# EAGLE design ft4222h (EAGLE 9.3.2)
COMPANY: IPL; CREVISION: V1.0; DESIGNER: Rafael Silva; LICENSE: GNU General Public License v3.0; LINK: https://github.com/gimbas/fmc
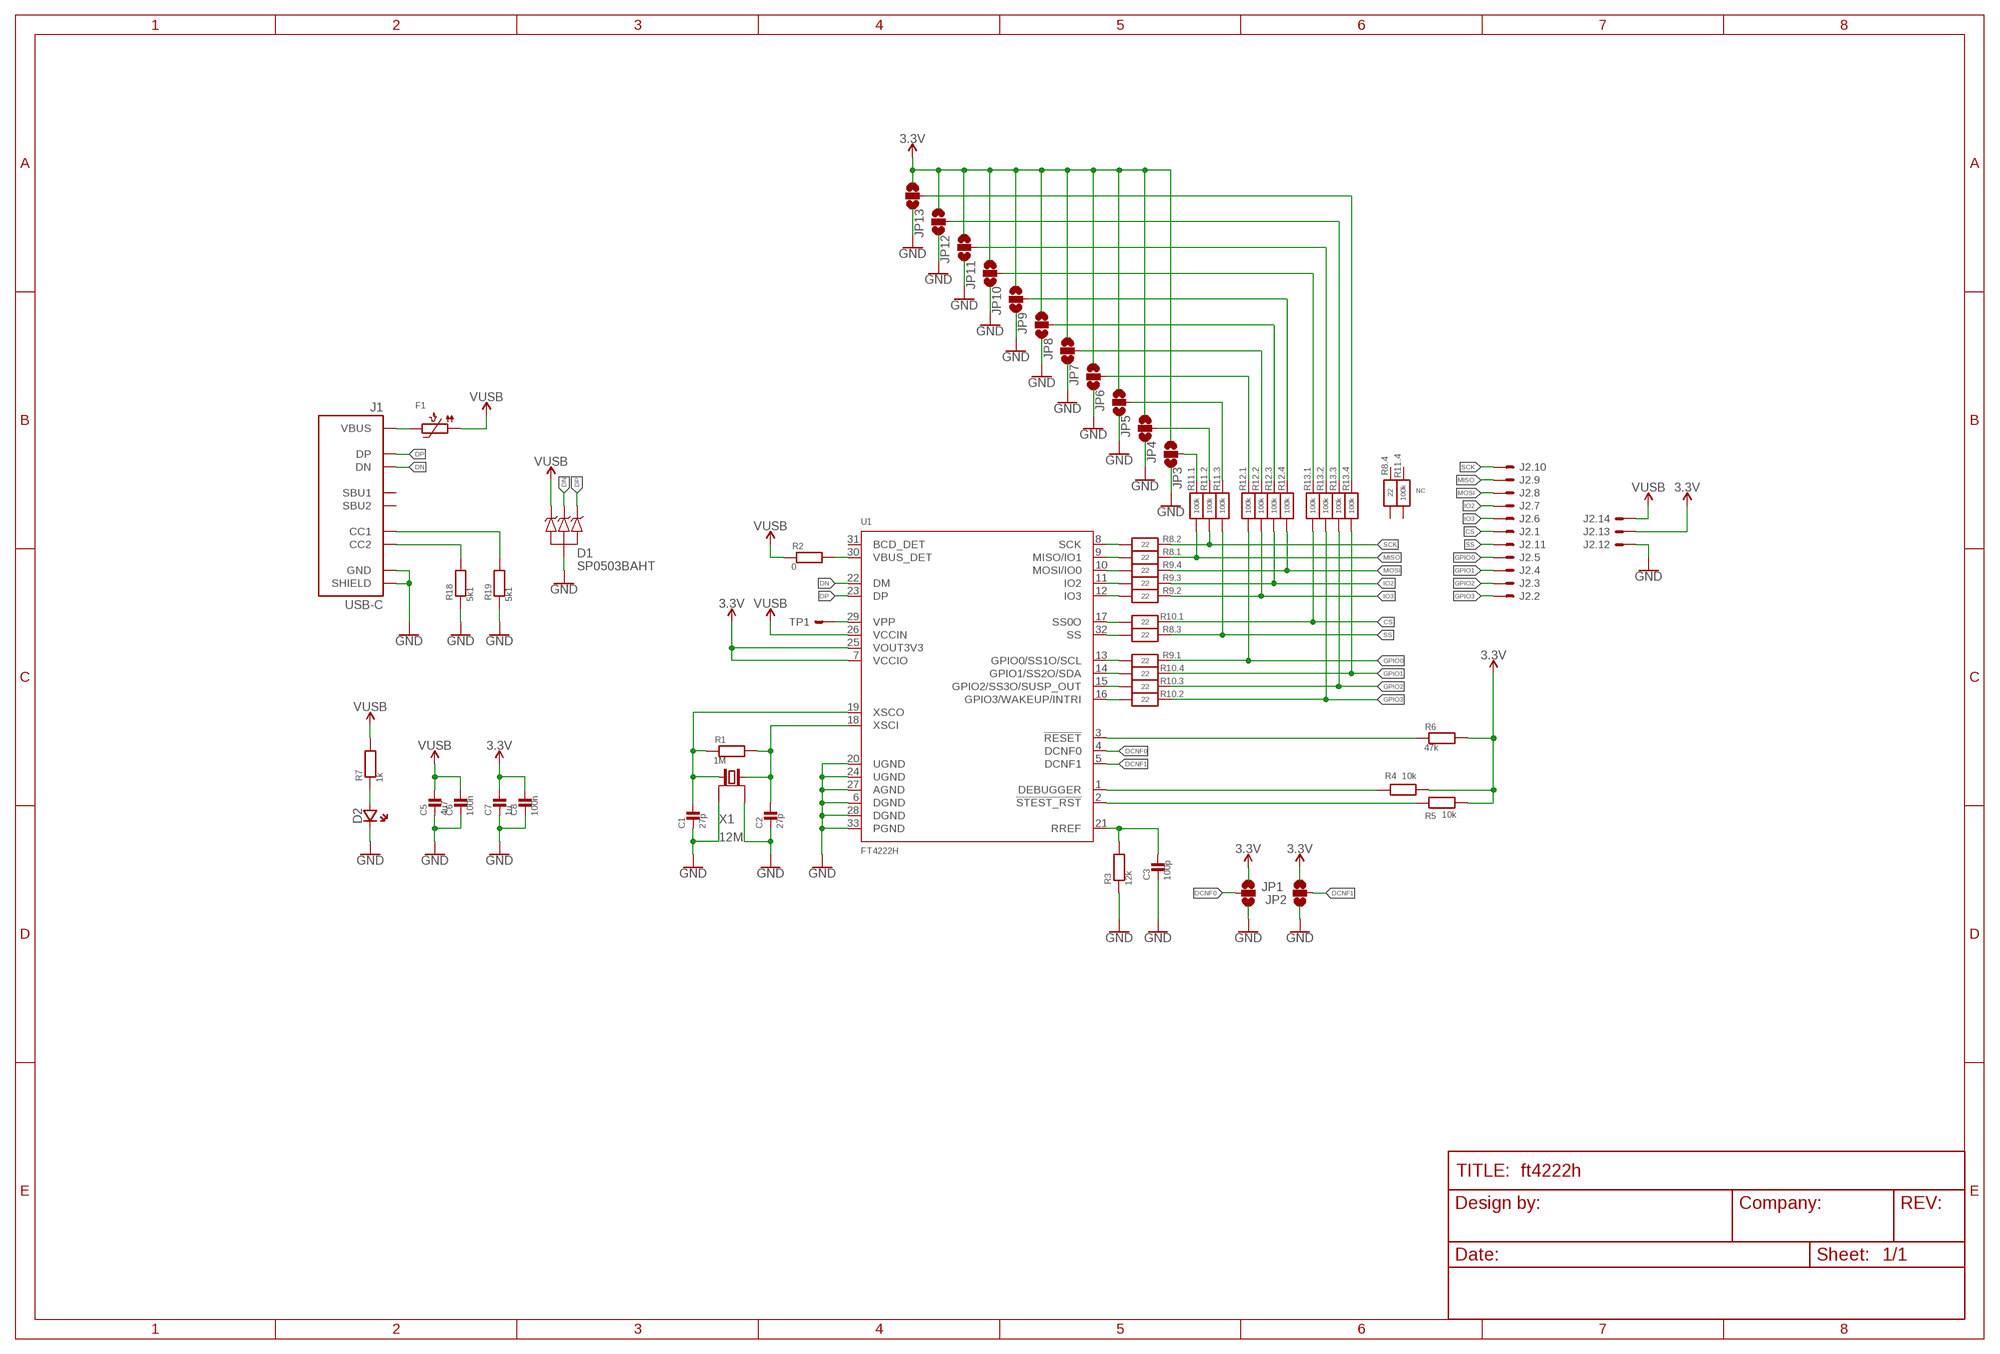
[diagram p0: schematic, sheet 1]

## Parts
C1  27p  MLCC_0402  [_0402]
C2  27p  MLCC_0402  [_0402]
C3  100p  MLCC_0402  [_0402]
C5  4u7  MLCC0603  [0603_WAVE]
C6  100n  MLCC_0402  [_0402]
C7  1u  MLCC0603  [0603_WAVE]
C8  100n  MLCC_0402  [_0402]
D1  SP0503BAHT  [SOT143]
D2  LED0603  [CHIPLED_0603]
F1  PTC0805  [0805]
J1  USB-C  [USB-C]
J2  14  [2X7_2.54]
JP1  JUMPER-SMT_3_NO_SILK  [SMT-JUMPER_3_NO_SILK]
JP2  JUMPER-SMT_3_NO_SILK  [SMT-JUMPER_3_NO_SILK]
JP3  JUMPER-SMT_3_NO_SILK  [SMT-JUMPER_3_NO_SILK]
JP4  JUMPER-SMT_3_NO_SILK  [SMT-JUMPER_3_NO_SILK]
JP5  JUMPER-SMT_3_NO_SILK  [SMT-JUMPER_3_NO_SILK]
JP6  JUMPER-SMT_3_NO_SILK  [SMT-JUMPER_3_NO_SILK]
JP7  JUMPER-SMT_3_NO_SILK  [SMT-JUMPER_3_NO_SILK]
JP8  JUMPER-SMT_3_NO_SILK  [SMT-JUMPER_3_NO_SILK]
JP9  JUMPER-SMT_3_NO_SILK  [SMT-JUMPER_3_NO_SILK]
JP10  JUMPER-SMT_3_NO_SILK  [SMT-JUMPER_3_NO_SILK]
JP11  JUMPER-SMT_3_NO_SILK  [SMT-JUMPER_3_NO_SILK]
JP12  JUMPER-SMT_3_NO_SILK  [SMT-JUMPER_3_NO_SILK]
JP13  JUMPER-SMT_3_NO_SILK  [SMT-JUMPER_3_NO_SILK]
R1  1M  RESISTOR_0402  [_0402]
R2  0  RESISTOR_0402  [_0402]
R3  12k  RESISTOR_0402  [_0402]
R4  10k  RESISTOR_0402  [_0402]
R5  10k  RESISTOR_0402  [_0402]
R6  47k  RESISTOR_0402  [_0402]
R7  1k  RESISTOR_0402  [_0402]
R8  22  RESISTOR_4PACK  [RESPACK_4X0603]
R9  22  RESISTOR_4PACK  [RESPACK_4X0603]
R10  22  RESISTOR_4PACK  [RESPACK_4X0603]
R11  100k  RESISTOR_4PACK  [RESPACK_4X0603]
R12  100k  RESISTOR_4PACK  [RESPACK_4X0603]
R13  100k  RESISTOR_4PACK  [RESPACK_4X0603]
R18  5k1  RESISTOR_0402  [_0402]
R19  5k1  RESISTOR_0402  [_0402]
TP1  TEST_POINT  [TEST_POINT]
U1  FT4222H  [QFN32]
X1  12M  CRYSTAL_4P  [4-SMD-3225]

## Nets
3.3V: C7.P$1 C8.1 J2.13 JP1.1 JP2.3 JP3.3 JP4.3 JP5.3 JP6.3 JP7.3 JP8.3 JP9.3 JP10.3 JP11.3 JP12.3 JP13.3 R4.2 R5.2 R6.2 U1.7(VCCIO) U1.25(VOUT3V3)
CS: J2.1 R10.8 R13.1
DCNF0: JP1.2 U1.4(DCNF0)
DCNF1: JP2.2 U1.5(DCNF1)
DEBUGGER: R4.1 U1.1(DEBUGGER)
DN: D1.3 J1.A7(DN) J1.B7(DN) U1.22(DM)
DP: D1.4 J1.A6(DP) J1.B6(DP) U1.23(DP)
GND: C1.2 C2.2 C3.2 C5.P$2 C6.2 C7.P$2 C8.2 D1.1 D2.C(CA) J1.A1/B12(GND) J1.B1/A12(GND) J1.SHIELD0(SHIELD) J1.SHIELD1(SHIELD) J1.SHIELD2(SHIELD) J1.SHIELD3(SHIELD) J2.12 JP1.3 JP2.1 JP3.1 JP4.1 JP5.1 JP6.1 JP7.1 JP8.1 JP9.1 JP10.1 JP11.1 JP12.1 JP13.1 R3.1 R18.1 R19.1 U1.6(DGND) U1.20(UGND) U1.24(UGND) U1.27(AGND) U1.28(DGND) U1.33(PGND) X1.2(GND) X1.4(GND)
GPIO0: J2.5 R9.8 R12.1
GPIO0_PIN: R9.1 U1.13(GPIO0/SS1O/SCL)
GPIO0_PULL: JP6.2 R12.8
GPIO1: J2.4 R10.5 R13.4
GPIO1_PIN: R10.4 U1.14(GPIO1/SS2O/SDA)
GPIO1_PULL: JP13.2 R13.5
GPIO2: J2.3 R10.6 R13.3
GPIO2_PIN: R10.3 U1.15(GPIO2/SS3O/SUSP_OUT)
GPIO2_PULL: JP12.2 R13.6
GPIO3: J2.2 R10.7 R13.2
GPIO3_PIN: R10.2 U1.16(GPIO3/WAKEUP/INTRI)
GPIO3_PULL: JP11.2 R13.7
IO2: J2.7 R9.6 R12.3
IO2_PIN: R9.3 U1.11(IO2)
IO2_PULL: JP8.2 R12.6
IO3: J2.6 R9.7 R12.2
IO3_PIN: R9.2 U1.12(IO3)
IO3_PULL: JP7.2 R12.7
MISO: J2.9 R8.8 R11.1
MISO_PIN: R8.1 U1.9(MISO/IO1)
MISO_PULL: JP3.2 R11.8
MOSI: J2.8 R9.5 R12.4
MOSI_PIN: R9.4 U1.10(MOSI/IO0)
MOSI_PULL: JP9.2 R12.5
N$1: J1.A5(CC1) R19.2
N$2: J1.B5(CC2) R18.2
N$3: F1.2 J1.A4/B9(VBUS) J1.B4/A9(VBUS)
N$4: TP1.1(S) U1.29(VPP)
RESETN: R6.1 U1.3(!RESET)
RREF: C3.1 R3.2 U1.21(RREF)
SCK: J2.10 R8.7 R11.2
SCK_PIN: R8.2 U1.8(SCK)
SCK_PULL: JP4.2 R11.7
SS: J2.11 R8.6 R11.3
SS0O_PIN: R10.1 U1.17(SS0O)
SS0O_PULL: JP10.2 R13.8
SS_PIN: R8.3 U1.32(SS)
SS_PULL: JP5.2 R11.6
STEST_RSTN: R5.1 U1.2(!STEST_RST)
VBUS_DET: R2.2 U1.30(VBUS_DET)
VUSB: C5.P$1 C6.1 D1.2 F1.1 J2.14 R2.1 R7.2 U1.26(VCCIN)
VUSB_LED: D2.A(AN) R7.1
XSCI: C2.1 R1.2 U1.18(XSCI) X1.3
XSCO: C1.1 R1.1 U1.19(XSCO) X1.1
Unconnected: J1.A8(SBU1) J1.B8(SBU2) R8.4 R8.5 R11.4 R11.5 U1.31(BCD_DET)

## Notes on the sheet
- NC

## Library data of the parts
C1-C3 C5-C8 = Passive Components > Capacitors > Multilayer Ceramic Capacitors MLCC:MLCC: KEMET’s X7R dielectric features a 125°C maximum operating temperature and is considered temperature stable. The Electronics Components, Assemblies and Materials Association (EIA) characterizes X7R dielectric as a Class II material. Components of this classification are fixed, ceramic dielectric capacitors suited for bypass and decoupling applications or for frequency discriminating circuits where Q and stability of capacitance characteristics are not critical. X7R exhibits a predictable change in capacitance with respect to time and voltage, boasting a minimal change in capacitance with reference to ambient temperature. Capacitance change is limited to ±15% from −55°C to +125°C.
D1 = Circuit Protection > ESD Suppressors \ TVS Diodes:SP0503BAHT
D2 = Opto-electronics > LED Emitters:LED: LED 0603 - 0603 Surface Mount Package 2mA: Green LED - Low Power (3.9mcd, 2ma, 1.7Vf) - Digikey: 475-2709-2-ND Orange LED - Low Power (9.8mcd, 2ma, 1.8Vf) - Digikey: 475-1194-2-ND Red LED - Low Power (5mcd, 2ma, 1.8Vf) - Digikey: 475-1195-2-ND Yellow LED - Low Power (7mcd, 2ma, 1.8Vf) - Digikey: 475-1196-2-ND 5mA: Blue LED - Low Power (17mcd, 5ma, 2.9Vf) - Digikey: LNJ937W8CRACT-ND 0805 - 0805 Surface Mount Package 2mA: Red LED (8.8mcd, 2mA, 1.8Vf, Clear) - Low Power [Digikey: 475-2510-1-ND] Green LED (5mcd, 2mA, 1.8Vf, Clear) - Low Power [Digikey: 475-2730-1-ND] Yellow LED (11.3mcd, 2mA, 1.8Vf, Clear) - Low Power [Digikey: 475-2555-1-ND] 20mA: Red LED (104mcd, 20mA, Diffused) - LS R976 [Digikey: 475-1278-6-ND] Red LED (12mcd, 20mA, 2.0Vf, Clear) - APT2012EC [Digikey: 754-1128-1-ND] Green LED (15mcd, 20mA, 2.2Vf, Clear) - APT2012GC [Digikey: 754-1131-1-ND] Orange LED (160mcd, 20mA, 2.1Vf, Clear) - APT2012SECK [Digikey: 754-1130-1-ND] 1206 - 1206 Surface Mount Package Green LED (26mcd, 20mA, Diffused) - LG N971 [Digikey: 475-1407-6-ND] Red LED (15mcd, 20mA, Diffused) - LH N974 [Digikey: 475-1416-6-ND] Cree - Cree High-Power Surface Mount LEDs XPEBWT-L1-0000-00D50 - White 111lm 350mA 2.9Vf 6200K 110° XTEAWT-00-0000-00000LEE3 - White 114lm 350mA 2.85Vf 5000K 115° Everlight - Everlight 45-21 Series Surface Mount LEDs 45-21/QK2C-B2832AC2CB2/2T - Warm White 2000mcd 20mA 3.25Vf 3050K 120° 45-21/LK2C-B38452C4CB2/2T - Nuetral White 2000mcd 20mA 3.25Vf 4150K 120° 45-21/LK2C-B50634C6CB2/2T - Cold White 2200mcd 20mA 3.25Vf 5650K 120° PLCC2 Reverse Mount LS T77K-J1L2-1-0-2-R18-Z - Red 11.25mcd 2mA 1.8Vf 630nm 120° LO T77K-L1M2-24-Z - Orange 19.6mcd 2mA 1.8Vf 606nm 120° LY T77K-K2M1-26-Z - Yellow 15.7mcd 2mA 1.8Vf 587nm 120°
F1 = Circuit Protection > Resettable Fuses - PPTC:PTC
J1 = Connectors > USB:USB-C
J2 = Connectors > Header:14
JP1-JP13 = Utility > Board:JUMPER-SMT_3_NO: Normally open jumper This jumper has three pads in close proximity to each other. Apply solder to close the connection(s).
R1-R7 R18 R19 = Passive Components > Resistors > Chip Resistors:RESISTOR: Resistors For new designs, use the packages preceded by an '_' character since they are more reliable: The following footprints should be used on most boards: _0402 - Standard footprint for regular board layouts _0603 - Standard footprint for regular board layouts _0805 - Standard footprint for regular board layouts _1206 - Standard footprint for regular board layouts For extremely tight-pitch boards where space is at a premium, the following 'micro-pitch' footprints can be used (smaller pads, no silkscreen outline, etc.): _0402MP - Micro-pitch footprint for very dense/compact boards _0603MP - Micro-pitch footprint for very dense/compact boards _0805MP - Micro-pitch footprint for very dense/compact boards _1206MP - Micro-pitch footprint for very dense/compact boards
R8-R13 = Passive Components > Resistors > Resistor Networks & Arrays:RESISTOR_4PACK: Resistor Packs (4 resistors) 4 x 0603 10K 1/16W - Digikey: YC164J-10KCT-ND
TP1 = Utility > Board:TEST_POINT
U1 = Semiconductors > Integrated Circuits - ICs > Interface ICs > USB Interface IC:FT4222H
X1 = Passive Components > Frequency Control & Timing Devices > Crystals:CRYSTAL_4P

## Board
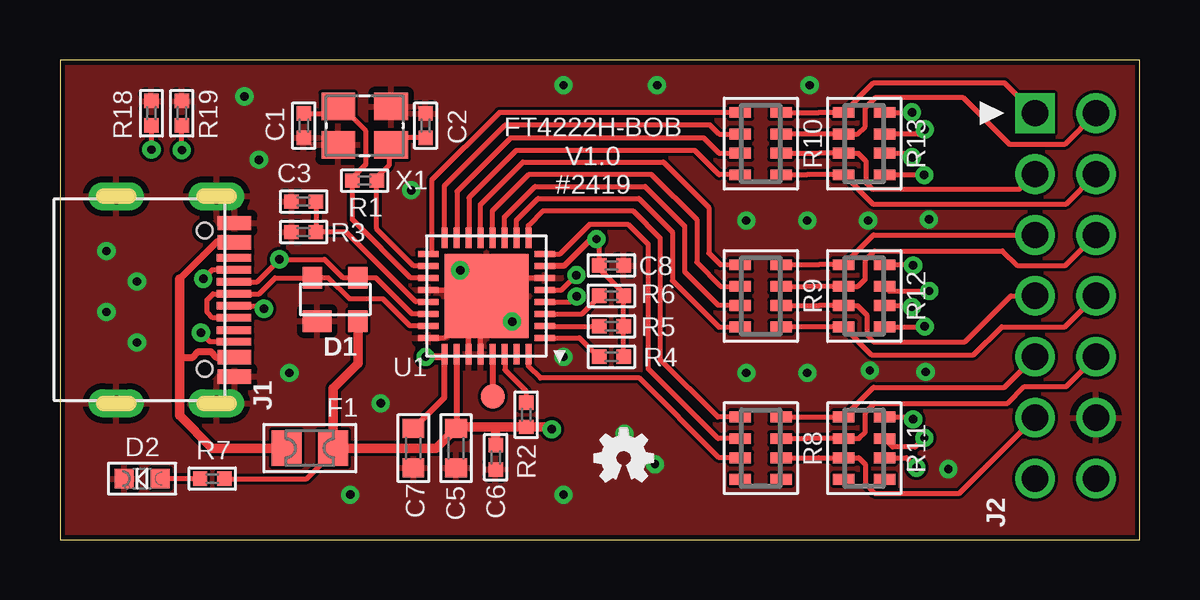
[diagram p1: board, top side]
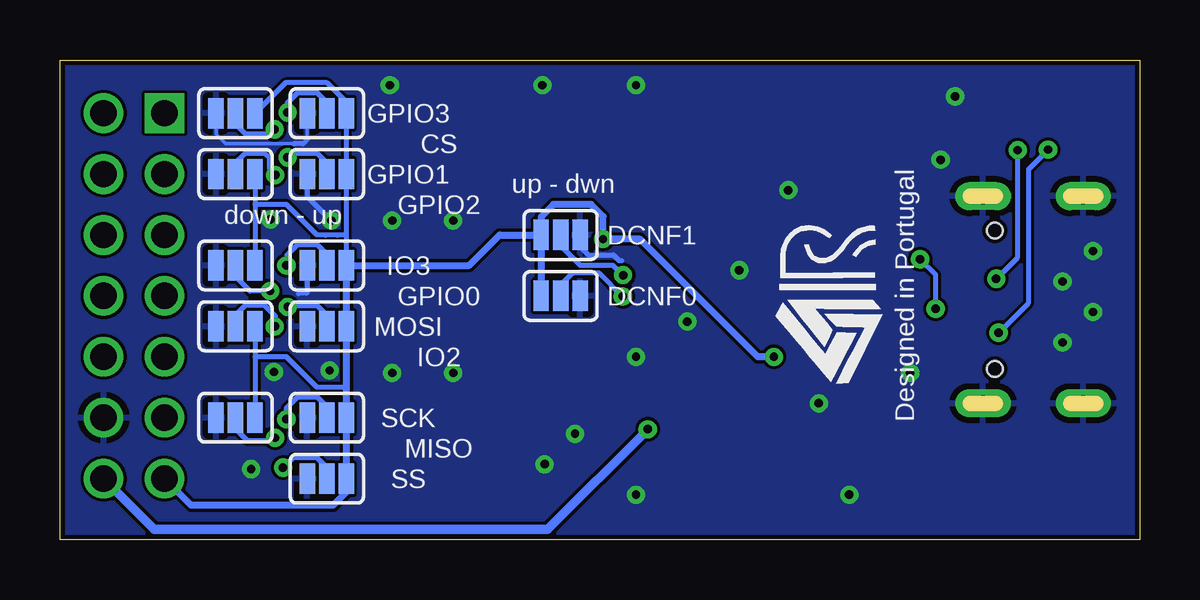
[diagram p2: board, bottom side, seen from below]

Size 45 x 20 mm. Coordinates in mm from the lower left corner, seen from the top.
Outline: 0,0 45,0 45,20 0,20 0,0
Copper layers (1*16): Top 0.035mm / dielectric 1.6mm / Bottom 0.035mm
Design rules "jlcpcb-dr": minimum track width 5mil, minimum drill 0.3mm, track to track 5mil, track to pad 5mil, pad to pad 5mil, via to via 5mil, smd to smd 5mil, copper to edge 0.2mm, drill to drill 5mil, minimum pad ring 10mil, minimum via ring 8mil, stop-mask expansion 4mil, vias tented up to drill 0.7mm, thermal gap 10mil

### Footprints (pad centres in the part's own frame; a part is rotated, then mirrored left to right if it is on the bottom)
_0402 = smd 0.6 x 0.6: 1 -0.508,0; 2 0.508,0
0603_WAVE = smd 0.8 x 0.9: P$1 -0.823,0; P$2 0.823,0
SOT143 = smd 1.2 x 0.9: 1 -0.711,-0.889 | smd 0.8 x 0.9: 2 0.989,-0.889; 3 0.989,0.911; 4 -0.911,0.911
CHIPLED_0603 = smd 0.8 x 0.8: A 0,-0.75; C 0,0.75
0805 = smd 1.245 x 1.473: 1 -0.965,0; 2 0.965,0
USB-C = smd 0.6 x 1.4: A1/B12 -3.2,7.276; A4/B9 -2.4,7.276; B1/A12 3.2,7.276; B4/A9 2.4,7.276 | smd 0.3 x 1.45: A5 -1.25,7.251; A6 -0.25,7.251; A7 0.25,7.251; A8 -1.75,7.251; B5 1.75,7.251; B6 0.75,7.251; B7 -0.75,7.251; B8 1.27,7.251 | drill 0.65 pad 1 long: SHIELD0 -4.32,6.526; SHIELD1 -4.32,2.346; SHIELD2 4.32,2.346; SHIELD3 4.32,6.526 | hole 0.65: -2.89,6.026; 2.89,6.026
2X7_2.54 = drill 1.1 square: 1 -7.62,-1.27 | drill 1.1: 2 -7.62,1.27; 3 -5.08,-1.27; 4 -5.08,1.27; 5 -2.54,-1.27; 6 -2.54,1.27; 7 0,-1.27; 8 0,1.27; 9 2.54,-1.27; 10 2.54,1.27; 11 5.08,-1.27; 12 5.08,1.27; 13 7.62,-1.27; 14 7.62,1.27
SMT-JUMPER_3_NO_SILK = smd 0.635 x 1.27: 1 -0.813,0; 2 0,0; 3 0.813,0
RESPACK_4X0603 = smd 0.45 x 0.9: 1 -1.3,-0.85; 2 -0.4,-0.85; 3 0.4,-0.85; 4 1.3,-0.85; 5 1.3,0.85; 6 0.4,0.85; 7 -0.4,0.85; 8 -1.3,0.85
TEST_POINT = smd 1 x 1: 1 0,0
QFN32 = smd 0.86 x 0.26: 1 -2.43,1.75; 2 -2.43,1.25; 3 -2.43,0.75; 4 -2.43,0.25; 5 -2.43,-0.25; 6 -2.43,-0.75; 7 -2.43,-1.25; 8 -2.43,-1.75; 17 2.43,-1.75; 18 2.43,-1.25; 19 2.43,-0.75; 20 2.43,-0.25; 21 2.43,0.25; 22 2.43,0.75; 23 2.43,1.25; 24 2.43,1.75 | smd 0.26 x 0.86: 9 -1.75,-2.43; 10 -1.25,-2.43; 11 -0.75,-2.43; 12 -0.25,-2.43; 13 0.25,-2.43; 14 0.75,-2.43; 15 1.25,-2.43; 16 1.75,-2.43; 25 1.75,2.43; 26 1.25,2.43; 27 0.75,2.43; 28 0.25,2.43; 29 -0.25,2.43; 30 -0.75,2.43; 31 -1.25,2.43; 32 -1.75,2.43 | smd 3.5 x 3.5: 33 0,0
4-SMD-3225 = smd 1.4 x 1.15: 1 -1.1,0.8; 2 1.1,0.8; 3 1.1,-0.8; 4 -1.1,-0.8

### Placement (x,y rotation side)
C1  10.16,17.26 270 top
C2  15.24,17.26 90 top
C3  10.16,14.1 180 top
C5  16.51,3.81 270 top
C6  18.16,3.43 270 top
C7  14.73,3.81 270 top
C8  22.99,11.43 0 top
D1  11.43,10 0 top
D2  3.43,2.54 90 top
F1  10.41,3.81 180 top
J1  0,10 270 top
J2  41.91,10.16 270 top
JP1  24.13,10.16 0 bottom
JP2  24.13,12.7 180 bottom
JP3  33.88,5.08 0 bottom
JP4  37.69,5.08 0 bottom
JP5  33.88,2.54 0 bottom
JP6  33.88,11.43 0 bottom
JP7  37.69,11.43 0 bottom
JP8  33.88,8.89 0 bottom
JP9  37.69,8.89 0 bottom
JP10  33.88,17.78 0 bottom
JP11  37.69,17.78 0 bottom
JP12  33.88,15.24 0 bottom
JP13  37.69,15.24 0 bottom
R1  12.7,14.97 0 top
R2  19.43,5.21 90 top
R3  10.16,12.82 0 top
R4  22.99,7.62 0 top
R5  22.99,8.89 0 top
R6  22.99,10.16 0 top
R7  6.35,2.54 0 top
R8  29.21,3.81 270 top
R9  29.21,10.16 270 top
R10  29.21,16.51 270 top
R11  33.52,3.81 270 top
R12  33.52,10.16 270 top
R13  33.52,16.51 270 top
R18  3.81,17.78 270 top
R19  5.08,17.78 270 top
TP1  18.03,5.97 0 top
U1  17.78,10.16 180 top
U$1  [OSHW-LOGO-MINI]  23.5,3.41 0 top
U$2  [RAFAEL_SILVA_5MM_ALT_3]  12.7,7.25 90 bottom
X1  12.7,17.26 0 top

### Tracks (layer width: path | path; a pad name or v marks a point on that pad's centre or on a via)
3.3V  (via drill 0.35)
  Top 0.2: U1.25 15.92,7.62 | v22.36,12.53 22.46,12.43 22.46,11.45 C8.1 22.48,11.3 23.5,10.29 R6.2 R5.2 R4.2
  Top 0.254: C7.P$1 16.03,5.93 U1.25 | v22.36,12.53 22.13,12.53 21.01,11.41 U1.7
  Top 0.3: 15.92,7.62 v15.24,7.62
  Bottom 0.2: JP6.3 33.06,12.7 | 33.06,12.7 JP12.3 JP10.3 33.06,18.24 33.87,19.05 35.6,19.05 JP11.3 | JP13.3 36.87,13.97 | 36.87,13.97 JP7.3 | JP9.3 36.87,7.62 | 36.87,7.62 JP4.3 | JP5.3 33.06,1.98 | 33.06,12.7 33.43,12.7 33.44,12.7 33.94,12.7 33.95,12.7 34.29,12.7 35.56,13.97 36.87,13.97 | 33.06,6.35 34.29,6.35 35.56,7.62 36.87,7.62
  Bottom 0.3: v15.24,7.62 15.91,7.62 20.82,12.53 v22.36,12.53 22.36,13.47 22.86,13.97 24.43,13.97 24.94,13.46 JP2.3 | JP5.3 JP3.3 33.06,6.35 JP8.3 JP6.3 27.94,11.43 26.67,12.7 JP2.3 | J2.13 39.53,1.43 33.61,1.43 33.06,1.98 | JP2.3 JP1.1
CS
  Top 0.2: R10.8 31.62,17.81 R13.1 33.91,19.05 39.37,19.05 J2.1
DCNF0  (via drill 0.35)
  Top 0.2: U1.4 21.31,9.91 v21.54,10.14
  Bottom 0.2: v21.54,10.14 22.51,11.11 23.64,11.11 24.16,10.59 24.13,10.56 JP1.2
DCNF1  (via drill 0.35)
  Top 0.2: U1.5 20.91,10.41 v21.53,11.02
  Bottom 0.2: v21.53,11.02 21.55,11.02 21.97,11.44 23.33,11.44 24.16,12.27 24.13,12.3 JP2.2 24.16,12.67
DEBUGGER
  Top 0.2: U1.1 21.65,8.41 22.44,7.62 R4.1
DN  (via drill 0.35)
  Top 0.2: U1.22 14.67,9.41 13.17,10.91 D1.3 11.81,10.91 11.03,11.69 v9.15,11.69 8.21,10.75 J1.B7 | J1.A7 8.38,9.75 v8.5,9.62
  Bottom 0.2: v8.5,9.62 8.5,11.04 v9.15,11.69
DP
  Top 0.2: U1.23 14.59,8.91 13.46,10.04 12.06,10.04 11.19,10.91 D1.4 8.96,10.91 8.3,10.25 J1.A6 6.38,10.25 6.12,10 6.12,9.5 6.37,9.25 J1.B6
GND  (via drill 0.35)
  Top 0.152: 17.03,9.41 U1.33 17.53,9.91
  Top 0.2: U1.27 17.03,9.41 | U1.28 17.53,9.91 | U1.24 16.03,8.41 U1.33 | U1.20 17.53,10.41 U1.33 | U1.6 18.53,10.91 U1.33 | U1.33 17.75,10.16 v16.68,11.23
  Bottom 0.152: JP10.1 34.69,16.7 | 34.87,16.51 35.27,16.51 35.28,16.52 35.76,16.52 35.77,16.51 38.1,16.51 38.5,16.91 JP11.1
  Bottom 0.2: JP2.1 23.32,12.22 22.96,11.87 21.93,11.87 21.7,11.63 21.59,11.63 | JP6.1 34.69,10.31 34.72,10.28 35.04,10.28 35.05,10.26 | 34.69,16.7 34.87,16.51 35.24,16.51 | JP12.1 34.69,14.3 v33.69,13.3
  other vias: 20.99,7.62 18.85,9.09 37.03,2.94 33.76,7.05 31.15,6.95 28.61,6.95 28.61,13.3 31.15,13.3 31.25,18.95 24.89,18.95 20.99,18.95 14.64,14.57 8.29,15.84 7.69,18.48 1.94,12.03 3.21,10.76 1.94,9.49 3.21,8.22 9.56,6.95 13.37,5.68 12.1,1.87 20.99,1.87 23.53,4.41 24.8,3.14 36.08,6.99 36.22,13.35
  pour Bottom: 0,0 45.02,0 45.02,20.02 0,20.02
  pour Top: 0,0 45.02,0 45.02,20.02 0,20.02
GPIO0
  Top 0.2: R9.8 31.62,11.46 R12.1 33.91,12.7 J2.5
GPIO0_PIN
  Top 0.2: U1.13 17.53,13.97 19.3,15.74 25.15,15.74 27.05,13.84 27.05,11.94 27.53,11.46 R9.1
GPIO0_PULL  (via drill 0.35)
  Top 0.2: R12.8 35.53,11.46 v35.56,11.43
  Bottom 0.2: v35.56,11.43 35.53,11.46 35.53,11.86 35.1,12.29 34.28,12.29 33.84,11.86 33.84,11.46 JP6.2
GPIO1
  Top 0.2: R10.5 31.12,15.21 R13.4 33.88,14 41.94,14 J2.4
GPIO1_PIN
  Top 0.2: U1.14 17.05,12.61 17.05,14.26 19.01,16.22 26.46,16.22 27.47,15.21 R10.4
GPIO1_PULL  (via drill 0.35)
  Top 0.2: v36.03,15.21 R13.5
  Bottom 0.2: v36.03,15.21 36.26,15.44 36.26,15.9 36.46,16.1 37.28,16.1 37.72,15.67 37.72,15.27 JP13.2
GPIO2
  Top 0.2: R10.6 31.62,16.11 R13.3 33.27,16.11 33.6,15.78 33.6,14.89 33.9,14.6 39.97,14.6 40.62,15.24 J2.3
GPIO2_PIN
  Top 0.2: U1.15 16.55,12.61 16.55,14.51 18.78,16.74 26.84,16.74 27.47,16.11 R10.3
GPIO2_PULL  (via drill 0.35)
  Top 0.2: R13.6 35.34,16.11 v35.52,15.94
  Bottom 0.2: JP12.2 33.84,15.27 33.84,15.67 34.29,16.11 35.34,16.11 v35.52,15.94
GPIO3
  Top 0.2: R10.7 R13.2 33.25,16.91 33.57,17.23 33.57,18 34.01,18.45 37.63,18.45 39.6,16.48 41.88,16.48 J2.2
GPIO3_PIN
  Top 0.2: U1.16 16.03,14.76 18.56,17.29 27.1,17.29 27.47,16.91 R10.2
GPIO3_PULL  (via drill 0.35)
  Top 0.2: R13.7 35.79,16.9 36.05,17.16 36.05,17.15 v36.05,17.1
  Bottom 0.2: JP11.2 37.62,17.71 37.62,17.25 37.28,16.92 36.25,16.92 36.07,17.1 v36.05,17.1
IO2
  Top 0.2: R9.6 31.62,9.76 R12.3 33.24,9.76 33.62,9.38 33.62,8.54 33.91,8.24 37.73,8.24 39.64,10.16 J2.7
IO2_PIN
  Top 0.2: U1.11 18.53,13.45 19.81,14.73 24.39,14.73 26.04,13.08 26.04,11.18 27.43,9.78 28.34,9.78 R9.3
IO2_PULL  (via drill 0.35)
  Top 0.2: R12.6 35.45,9.76 v35.51,9.7
  Bottom 0.2: JP8.2 33.84,8.92 33.84,9.32 34.28,9.75 35.46,9.75 v35.51,9.7
IO3
  Top 0.2: R9.7 31.12,10.56 R12.2 33.27,10.56 33.57,10.86 33.57,11.65 33.95,12.04 39.29,12.04 39.9,11.43 41.91,11.43 J2.6
IO3_PIN
  Top 0.2: U1.12 18.03,13.71 19.55,15.24 24.64,15.24 26.54,13.34 26.54,11.56 27.54,10.56 R9.2
IO3_PULL  (via drill 0.35)
  Top 0.2: R12.7 34.57,10.36 v36.24,10.36
  Bottom 0.2: JP7.2 37.62,11.36 37.62,10.9 37.08,10.36 v36.24,10.36
MISO
  Top 0.2: R8.8 31.62,5.11 R11.1 33.91,6.35 39.37,6.35 J2.9
MISO_PIN
  Top 0.2: U1.9 19.53,13.1 20.14,13.71 23.88,13.71 25.02,12.57 25.02,7.51 27.42,5.11 R8.1
MISO_PULL  (via drill 0.35)
  Top 0.2: R11.8 35.47,5.11 v35.56,5.01
  Bottom 0.2: v35.56,5.01 35.56,5.48 35.09,5.95 34.28,5.95 33.84,5.51 33.84,5.11 JP3.2
MOSI
  Top 0.2: R9.5 R12.4 33.83,7.7 38.08,7.7 39.25,8.88 41.9,8.88 J2.8
MOSI_PIN
  Top 0.2: U1.10 19.03,13.31 19.93,14.22 24.13,14.22 25.53,12.83 25.53,10.79 27.46,8.86 R9.4
MOSI_PULL  (via drill 0.35)
  Top 0.2: R12.5 36.02,8.86 v36.05,8.89
  Bottom 0.2: v36.05,8.89 36.03,8.91 36.03,9.32 36.46,9.75 37.28,9.75 37.72,9.32 37.72,8.92 JP9.2
N$1  (via drill 0.35)
  Top 0.2: J1.A5 6.35,11.25 v5.97,10.88 | v5.08,16.24 R19.2
  Bottom 0.2: v5.97,10.88 5.08,11.77 v5.08,16.24
N$2  (via drill 0.35)
  Top 0.2: J1.B5 6.25,8.25 v5.88,8.62 | R18.2 v3.81,16.26
  Bottom 0.2: v5.88,8.62 4.62,9.88 4.62,15.45 v3.81,16.26
N$3
  Top 0.2: 7.27,12.41 J1.A4/B9 | 4.98,7.72 5.1,7.6
  Top 0.3: 7.27,12.41 6.53,12.41 4.98,10.86 | 5.1,7.6 5.53,7.6 5.77,7.83 6.29,7.83 6.52,7.6 J1.B4/A9
  Top 0.4: F1.2 6.35,3.81 4.98,5.18 4.98,7.72 4.98,10.86
N$4
  Top 0.152: TP1.1
  Top 0.254: U1.29 TP1.1
RESETN
  Top 0.2: U1.3 21.77,9.41 22.48,10.12 R6.1
RREF
  Top 0.2: U1.21 15.33,9.93 14.83,9.93 11.93,12.82 R3.2 C3.1
SCK
  Top 0.2: R8.7 31.12,4.21 R11.2 33.31,4.21 33.57,4.47 33.57,5.3 33.95,5.69 39.51,5.69 40.2,6.38 41.94,6.38 J2.10
SCK_PIN
  Top 0.2: U1.8 20.84,11.91 22.09,13.15 23.68,13.15 24.51,12.32 24.51,7.13 27.43,4.21 R8.2
SCK_PULL  (via drill 0.35)
  Top 0.2: R11.7 34.72,3.86 35.65,3.86 v36.03,4.24
  Bottom 0.2: JP4.2 37.62,5.01 37.62,4.55 37.21,4.14 36.13,4.14 v36.03,4.24
SS
  Top 0.2: R8.6 31.62,3.41 R11.3 33.3,3.41 33.57,3.14 33.57,2.32 33.95,1.93 37.49,1.93 J2.11
SS0O_PIN
  Top 0.2: U1.17 15.49,11.91 15.49,14.99 18.32,17.81 R10.1
SS0O_PULL  (via drill 0.35)
  Top 0.2: R13.8 v35.51,17.81 v35.52,17.81
  Bottom 0.2: v35.52,17.81 35.52,18.23 35.1,18.64 34.28,18.64 33.94,18.31 33.94,17.85 JP10.2
SS_PIN
  Top 0.2: R8.3 27.47,3.41 24.15,6.73 20.02,6.73 19.53,7.22 U1.32
SS_PULL  (via drill 0.35)
  Top 0.2: R11.6 35.29,3.41 v35.7,3
  Bottom 0.2: JP5.2 33.84,2.57 33.84,2.97 34.28,3.41 35.29,3.41 v35.7,3
STEST_RSTN
  Top 0.2: U1.2 20.23,8.89 R5.1
VBUS_DET
  Top 0.2: R2.2 19.43,6.19 18.55,7.08 18.55,7.71 U1.30
VUSB  (via drill 0.35)
  Top 0.2: 16.53,4.65 C5.P$1 16.58,4.7 | R7.2 10.29,2.54 11.38,3.63 F1.1 | v20.5,4.6 20.4,4.7
  Top 0.254: U1.26 16.53,4.65
  Top 0.4: C5.P$1 15.69,3.81 F1.1 11.38,6.3 12.42,7.34 D1.2 | 16.58,4.7 18.16,4.7 | 18.16,4.7 R2.1 20.4,4.7 | C6.1 18.16,4.7
  Bottom 0.4: J2.14 41.07,0.43 24.67,0.43 v20.5,4.6
VUSB_LED
  Top 0.2: R7.1 D2.A
XSCI
  Top 0.152: 13.72,16.38 X1.3 14.09,16.75
  Top 0.2: 13.72,16.38 13.72,15.6 13.21,15.1 R1.2 13.21,12.95 14.75,11.41 U1.18 | C2.1 14.09,16.75
XSCO
  Top 0.152: 11.31,17.77 X1.1
  Top 0.2: U1.19 14.62,10.91 12.19,13.34 R1.1 12.19,15.1 12.76,15.66 12.76,17.03 11.73,18.06 X1.1 | C1.1 11.31,17.77

### Text on the board
tPlace: FT4222H-BOB / V1.0 / #2419
bPlace: GPIO3 | CS | up - dwn | GPIO1 | GPIO2 | down - up | DCNF1 | IO3 | Designed in Portugal | DCNF0 | GPIO0 | MOSI | IO2 | SCK | MISO | SS